# Altium schematic sheet TIDA-01576_ADS8686S_ISO_Interface_Pg3-PowerSupply.SchDoc
size 431 x 279 mm; Date: Not shown in title block; ApprovedBy: Not shown in title block; CheckedBy: Not shown in title block; Author: Not shown in title block; CompanyName: Not shown in title block; Engineer: Not shown in title block; Organization: Not shown in title block; Address1: Not shown in title block; Address2: Not shown in title block; Address3: Not shown in title block; Address4: Not shown in title block; DocumentNumber: 1; Revision: Use project parameter SCH_Rev; SheetNumber: 3; SheetTotal: 8; PageSetup: Record=PageOptions|CenterHorizontal=True|CenterVertical=True|PrintScale=1.00|XCorrection=1.00|YCorrection=1.00|PrintKind=0|BorderSize=5000000|LeftOffset=0|BottomOffset=0|Orientation=2|PaperLength=1000|PaperWidth=1000|Scale=100|PaperSource=15|PrintQuality=600|MediaType=1|DitherType=10|PaperKind=Letter|PrintScaleMode=1; CurrentTime: Not shown in title block; CurrentDate: Not shown in title block; Time: Not shown in title block; DocumentFullPathAndName: Not shown in title block; DocumentName: Not shown in title block; ModifiedDate: Not shown in title block; ImagePath: Not shown in title block
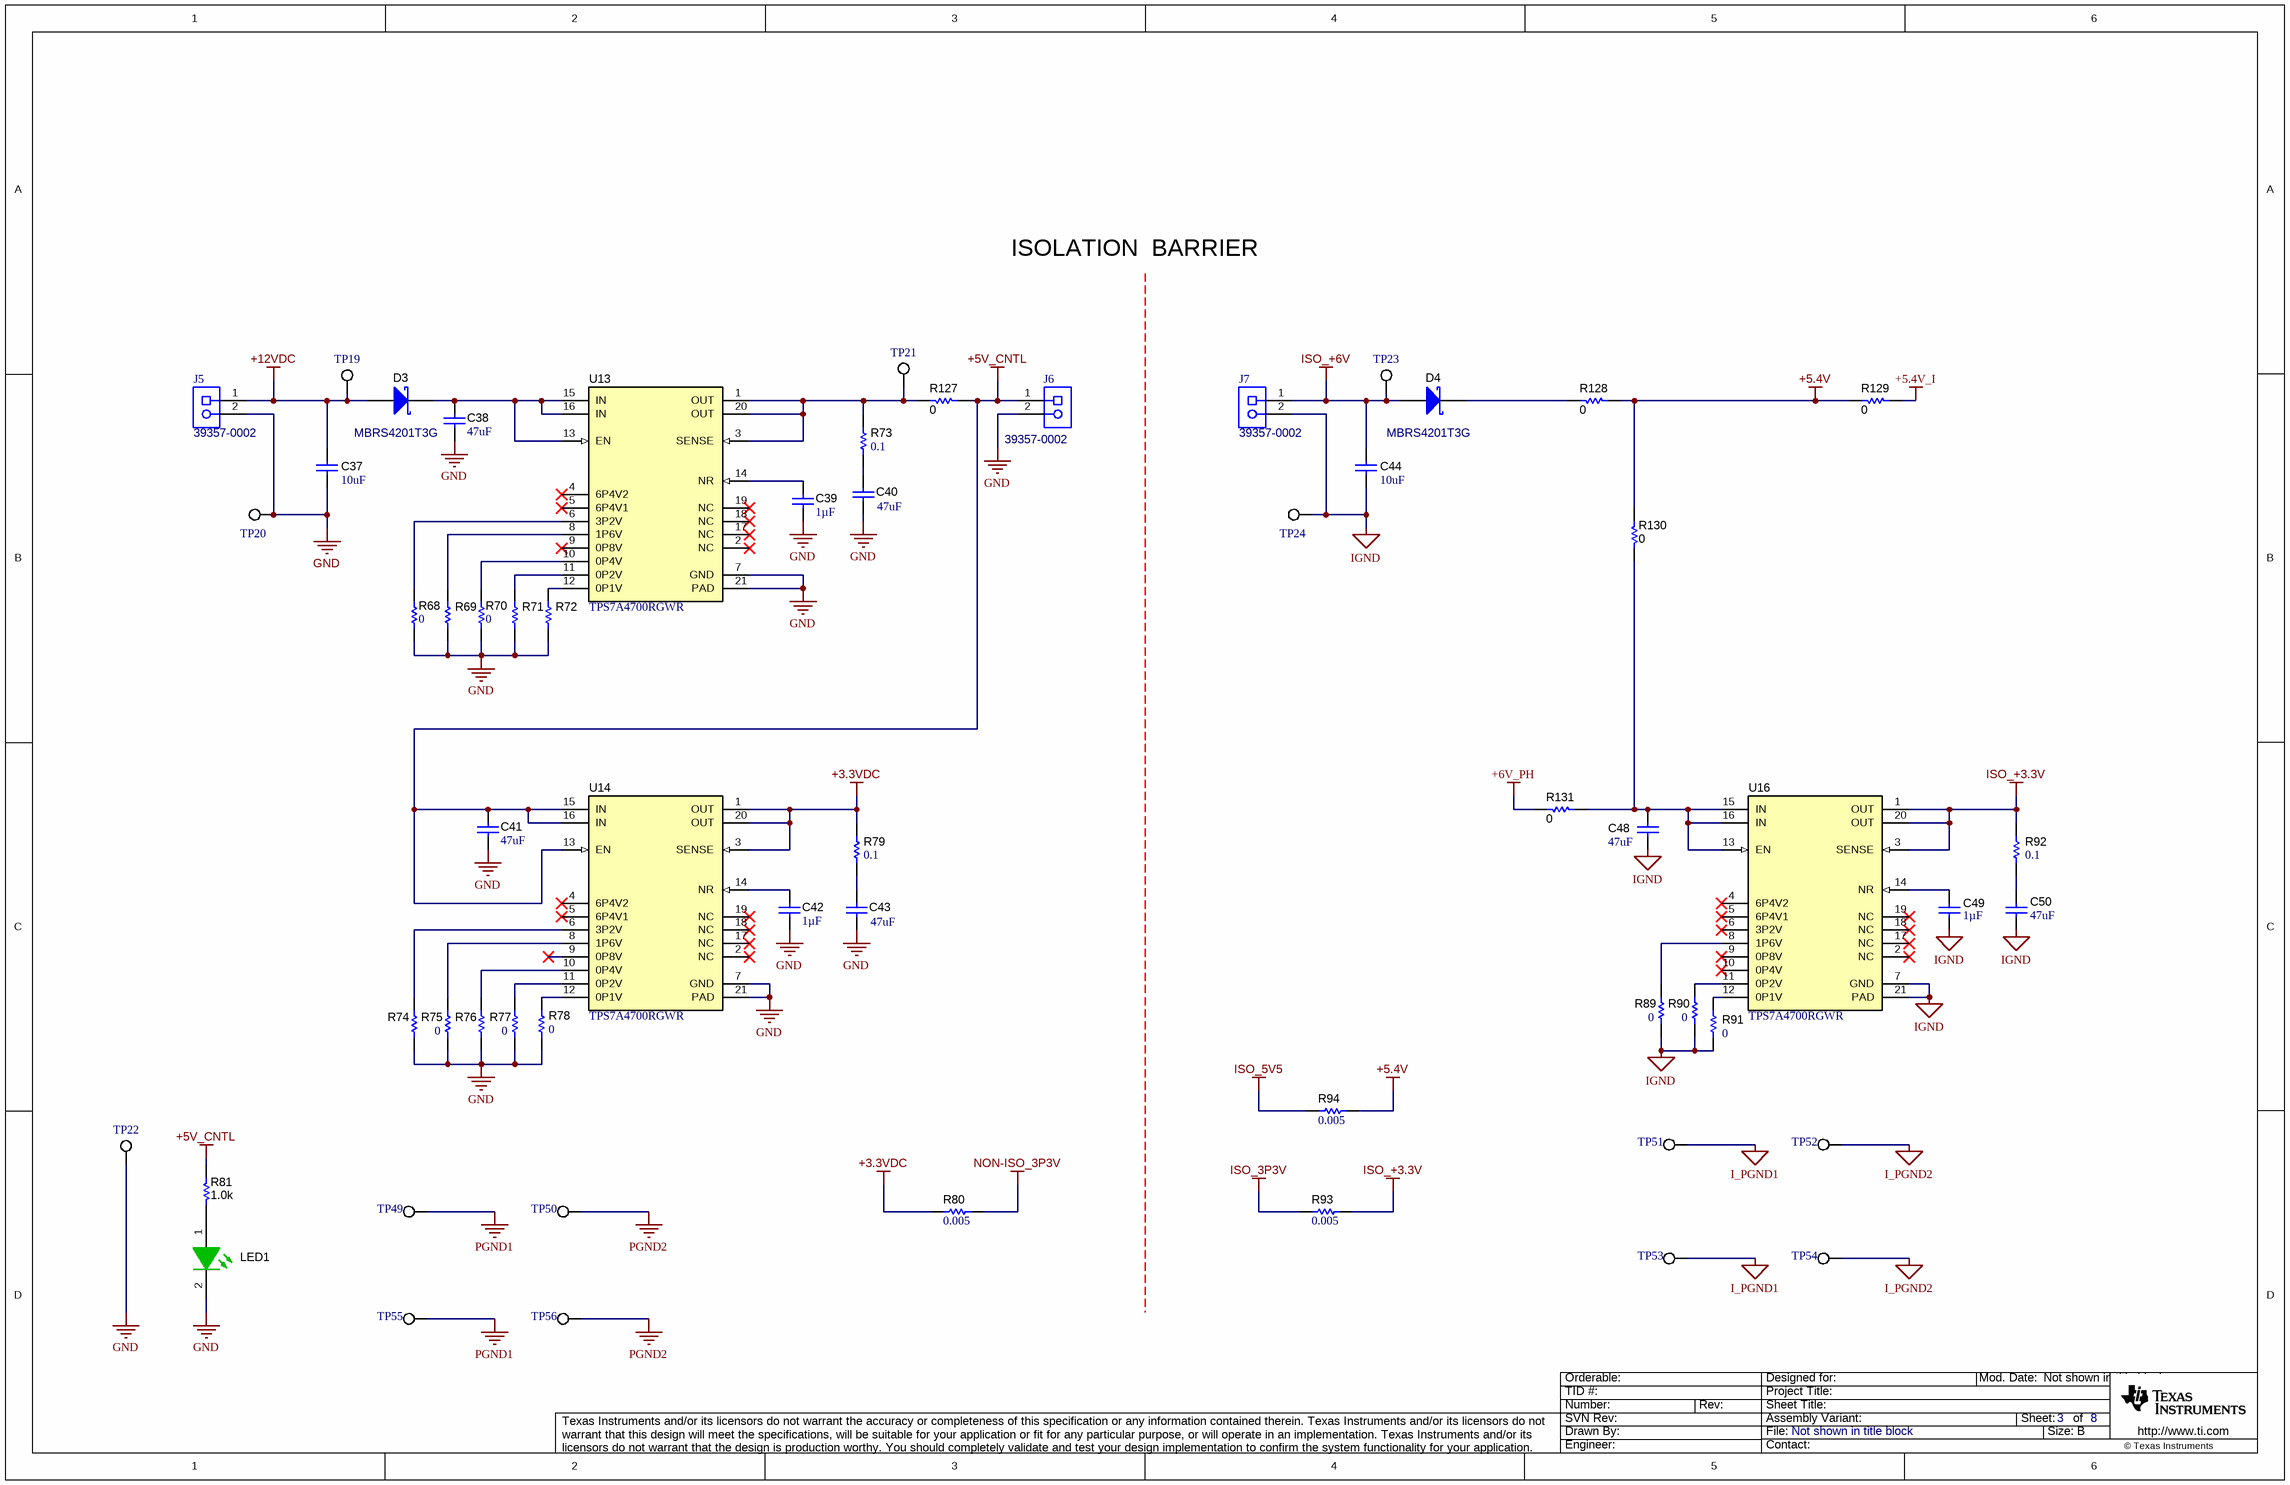
[diagram p0: TIDA-01576_ADS8686S_ISO_Interface_Pg3-PowerSupply.SchDoc]

## Parts
C37  ValueDisplayed: 10uF  [1210_270]  (hidden comment: GRM32ER71H106KA12L)
C38  ValueDisplayed: 47uF  [1206_190]  (hidden comment: C3216X5R1E476M160AC)
C39  Cap_F: 1µF  [0603]  (hidden comment: C1608X7R1C105K080AC)
C40  ValueDisplayed: 47uF  [0805_HV]  (hidden comment: C2012X5R1A476M125AC)
C41  ValueDisplayed: 47uF  [1206_190]  (hidden comment: C3216X5R1E476M160AC)
C42  Cap_F: 1µF  [0603]  (hidden comment: C1608X7R1C105K080AC)
C43  ValueDisplayed: 47uF  [0805_HV]  (hidden comment: C2012X5R1A476M125AC)
C44  ValueDisplayed: 10uF  [1210_270]  (hidden comment: GRM32ER71H106KA12L)
C48  ValueDisplayed: 47uF  [1206_190]  (hidden comment: C3216X5R1E476M160AC)
C49  Cap_F: 1µF  [0603]  (hidden comment: C1608X7R1C105K080AC)
C50  ValueDisplayed: 47uF  [0805_HV]  (hidden comment: C2012X5R1A476M125AC)
D3  MBRS4201T3G  [SMC]
D4  MBRS4201T3G  [SMC]
J5  39357-0002  [MOLEX_39357-0002]
J6  39357-0002  [MOLEX_39357-0002]
J7  39357-0002  [MOLEX_39357-0002]
LED1  LTST-C193TGKT-5A  [LTST-C193_Green_S]  (value not drawn)
R68  ValueDisplayed: 0  [0603]  (hidden comment: CRCW06030000Z0EA)
R69  CRCW06030000Z0EA  [0603]  (value not drawn)
R70  ValueDisplayed: 0  [0603]  (hidden comment: CRCW06030000Z0EA)
R71  CRCW06030000Z0EA  [0603]  (value not drawn)
R72  CRCW06030000Z0EA  [0603]  (value not drawn)
R73  ValueDisplayed: 0.1  [0603]  (hidden comment: ERJ-3RSFR10V)
R74  CRCW06030000Z0EA  [0603]  (value not drawn)
R75  ValueDisplayed: 0  [0603]  (hidden comment: CRCW06030000Z0EA)
R76  CRCW06030000Z0EA  [0603]  (value not drawn)
R77  ValueDisplayed: 0  [0603]  (hidden comment: CRCW06030000Z0EA)
R78  ValueDisplayed: 0  [0603]  (hidden comment: CRCW06030000Z0EA)
R79  ValueDisplayed: 0.1  [0603]  (hidden comment: ERJ-3RSFR10V)
R80  ValueDisplayed: 0.005  [0805_HV]  (hidden comment: ERJ6LWFR005V)
R81  ValueDisplayed: 1.0k  [0603]  (hidden comment: RC0603JR-071KL)
R89  ValueDisplayed: 0  [0603]  (hidden comment: CRCW06030000Z0EA)
R90  ValueDisplayed: 0  [0603]  (hidden comment: CRCW06030000Z0EA)
R91  ValueDisplayed: 0  [0603]  (hidden comment: CRCW06030000Z0EA)
R92  ValueDisplayed: 0.1  [0603]  (hidden comment: ERJ-3RSFR10V)
R93  ValueDisplayed: 0.005  [0805_HV]  (hidden comment: ERJ6LWFR005V)
R94  ValueDisplayed: 0.005  [0805_HV]  (hidden comment: ERJ6LWFR005V)
R127  ValueDisplayed: 0  [0603]  (hidden comment: CRCW06030000Z0EA)
R128  ValueDisplayed: 0  [0603]  (hidden comment: CRCW06030000Z0EA)
R129  ValueDisplayed: 0  [0603]  (hidden comment: CRCW06030000Z0EA)
R130  ValueDisplayed: 0  [0603]  (hidden comment: CRCW06030000Z0EA)
R131  ValueDisplayed: 0  [0603]  (hidden comment: CRCW06030000Z0EA)
TP19  5015  [Testpoint_Keystone_Miniature]  (value not drawn)
TP20  5015  [Testpoint_Keystone_Miniature]  (value not drawn)
TP21  5015  [Testpoint_Keystone_Miniature]  (value not drawn)
TP22  5015  [Testpoint_Keystone_Miniature]  (value not drawn)
TP23  5015  [Testpoint_Keystone_Miniature]  (value not drawn)
TP24  5015  [Testpoint_Keystone_Miniature]  (value not drawn)
TP49  5015  [Testpoint_Keystone_Miniature]  (value not drawn)
TP50  5015  [Testpoint_Keystone_Miniature]  (value not drawn)
TP51  5015  [Testpoint_Keystone_Miniature]  (value not drawn)
TP52  5015  [Testpoint_Keystone_Miniature]  (value not drawn)
TP53  5015  [Testpoint_Keystone_Miniature]  (value not drawn)
TP54  5015  [Testpoint_Keystone_Miniature]  (value not drawn)
TP55  5015  [Testpoint_Keystone_Miniature]  (value not drawn)
TP56  5015  [Testpoint_Keystone_Miniature]  (value not drawn)
U13  TPS7A4700RGWR  [RGW0020A]
U14  TPS7A4700RGWR  [RGW0020A]
U16  TPS7A4700RGWR  [RGW0020A]

## Nets
+3.3VDC: R79.2 R80.2 U14.1(OUT) U14.3(SENSE) U14.20(OUT)
+5.4V: R94.2 R128.1 R129.2 R130.1
+5.4V_I: R129.1
+5V_CNTL: C41.1 J6.1 R81.2 R127.1 U14.13(EN) U14.15(IN) U14.16(IN)
+6V_PH: R131.1
+12VDC: C37.1 D3.2(A) J5.1 TP19.1
GND: C37.2 C38.2 C39.2 C40.2 C41.2 C42.2 C43.2 J5.2 J6.2 LED1.2(K) R68.1 R69.1 R70.1 R71.1 R72.1 R74.1 R75.1 R76.1 R77.1 R78.1 TP20.1 TP22.1 U13.7(GND) U13.21(PAD) U14.7(GND) U14.21(PAD)
I_PGND1: TP51.1 TP53.1
I_PGND2: TP52.1 TP54.1
IGND: C44.2 C48.2 C49.2 C50.2 J7.2 R89.1 R90.1 R91.1 TP24.1 U16.7(GND) U16.21(PAD)
ISO_3P3V: R93.1
ISO_5V5: R94.1
ISO_+3.3V: R92.2 R93.2 U16.1(OUT) U16.3(SENSE) U16.20(OUT)
ISO_+6V: C44.1 D4.2(A) J7.1 TP23.1
NON-ISO_3P3V: R80.1
PGND1: TP49.1 TP55.1
PGND2: TP50.1 TP56.1
NetC38_1: C38.1 D3.1(K) U13.13(EN) U13.15(IN) U13.16(IN)
NetC39_1: C39.1 U13.14(NR)
NetC40_1: C40.1 R73.1
NetC42_1: C42.1 U14.14(NR)
NetC43_1: C43.1 R79.1
NetC48_1: C48.1 R130.2 R131.2 U16.13(EN) U16.15(IN) U16.16(IN)
NetC49_1: C49.1 U16.14(NR)
NetC50_1: C50.1 R92.1
NetD4_1: D4.1(K) R128.2
NetLED1_1: LED1.1(A) R81.1
NetR68_2: R68.2 U13.6(3P2V)
NetR69_2: R69.2 U13.8(1P6V)
NetR70_2: R70.2 U13.10(0P4V)
NetR71_2: R71.2 U13.11(0P2V)
NetR72_2: R72.2 U13.12(0P1V)
NetR73_2: R73.2 R127.2 TP21.1 U13.1(OUT) U13.3(SENSE) U13.20(OUT)
NetR74_2: R74.2 U14.6(3P2V)
NetR75_2: R75.2 U14.8(1P6V)
NetR76_2: R76.2 U14.10(0P4V)
NetR77_2: R77.2 U14.11(0P2V)
NetR78_2: R78.2 U14.12(0P1V)
NetR89_2: R89.2 U16.8(1P6V)
NetR90_2: R90.2 U16.11(0P2V)
NetR91_2: R91.2 U16.12(0P1V)

Not connected (* = marked no-connect by the designer): U13 2(NC)* 4(6P4V2)* 5(6P4V1)* 9(0P8V)* 17(NC)* 18(NC)* 19(NC)*; U14 2(NC)* 4(6P4V2)* 5(6P4V1)* 9(0P8V)* 17(NC)* 18(NC)* 19(NC)*; U16 2(NC)* 4(6P4V2)* 5(6P4V1)* 6(3P2V)* 9(0P8V)* 10(0P4V)* 17(NC)* 18(NC)* 19(NC)*

## Notes on the sheet
- ISOLATION  BARRIER
- Drawn By:
- SVN Rev:
- Number:
- TID #:
- Orderable:
- Rev:
- Sheet Title:
- File:
- Project Title:
- Designed for:
- Assembly Variant:
- Mod. Date:
- Sheet:
- Size:
- of
- B
- http://www.ti.com
- Texas Instruments and/or its licensors do not warrant the accuracy or completeness of this specification or any information contained therein. Texas Instruments and/or its licensors do not warrant that this design will meet the specifications, will be suitable for your application or fit for any particular purpose, or will operate in an implementation. Texas Instruments and/or its licensors do not warrant that the design is production worthy. You should completely validate and test your design implementation to confirm the system functionality for your application.
- Engineer:
- Contact:
- © Texas Instruments

## Library data of the parts
C37 C44 = CMP-0009226-3: CAP, CERM, 10 uF, 50 V, +/- 10%, X7R, 1210; Manufacturer: MuRata; TaMin_C: -55°C; Polarized: N; SizeAreaWB_mm2: 14.7; Value1: Unknown; U/M: EA; Value: 10uF; TaMax_C: 125°C; SizeZ_mm: 2.7; SizeX_mm: 3.2; SizeY_mm: 2.5; Cap_Case: 1210; Value2: 50V; SizeArea_mm2: 8; Cap_F: 10µF; AEC Category: Q200; Supplier Part Number 2: 40X5911; Supplier 2: Newark; TempCo: X7R; RoHS: Y; MountType: SMT; Supplier 1: Digi-Key; PackageReference: 1210; Tolerance_%: 10%; CompType: Capacitor; PartNumber: GRM32ER71H106KA12L; AEC Qualified: N; VDC_V: 50V; ComponentLink1Description: Datasheet link; Supplier Part Number 1: 490-6544-1-ND; Technology: Ceramic; ComponentLink1URL: http://search.murata.co.jp/Ceramy/image/img/A01X/G101/ENG/GRM32ER71H106KA12-04A.pdf; AEC Grade: N/A; Supplier 3: Mouser; Supplier Part Number 3: 81-GRM32ER71H106KA2L
C38 C41 = CMP-0008656-1: CAP, CERM, 47 uF, 25 V, +/- 20%, X5R, 1206_190; Manufacturer: TDK; TaMin_C: -55°C; Polarized: N; SizeAreaWB_mm2: 10.92; Value1: Unknown; U/M: EA; Value: 47uF; TaMax_C: 85°C; SizeZ_mm: 1.9; SizeX_mm: 3.2; SizeY_mm: 1.6; Cap_Case: 1206; Value2: 25V; SizeArea_mm2: 5.12; Cap_F: 47µF; AEC Category: Q200; ComponentLink1URL: https://product.tdk.com/info/en/catalog/datasheets/mlcc_commercial_general_en.pdf; Publisher: Texas Instruments; TempCo: X5R; Published: 2008-06-19; RoHS: Y; MountType: SMT; Supplier 1: Digi-Key; PackageReference: 1206_190; Tolerance_%: 20%; CompType: Capacitor; LatestRevisionDate: 2017-03-09; PartNumber: C3216X5R1E476M160AC; AEC Qualified: N; VDC_V: 25V; ComponentLink1Description: Datasheet link; AEC Grade: N/A; Supplier Part Number 1: 445-8047-1-ND; Technology: Ceramic
C39 C42 C49 = CMP-0007037-1: CAP, CERM, 1 uF, 16 V, +/- 10%, X7R, 0603; Manufacturer: TDK; TaMin_C: -55°C; ESR_ohm: 5.7m; Polarized: N; SizeAreaWB_mm2: 4.68; Value1: 0.0057 ohm; U/M: EA; Value: 1uF; TaMax_C: 125°C; SizeZ_mm: 1; SizeX_mm: 1.6; SizeY_mm: 0.8; Value2: 16V; SizeArea_mm2: 1.28; AEC Category: Q200; ComponentLink1URL: http://www.tdk.co.jp/tefe02/e412_c.pdf; Supplier Part Number 2: 90R7686; Publisher: Texas Instruments; Supplier 2: Newark; Supplier Part Number 3: 810-C1608X7R1C105K; TempCo: X7R; Supplier 3: Mouser; Published: 2008-06-19; RoHS: Y; MountType: SMT; Supplier 1: Digi-Key; PackageReference: 0603; Tolerance_%: 10%; Cap_Case: 0603; CompType: Capacitor; LatestRevisionDate: 2017-03-09; PartNumber: C1608X7R1C105K080AC; AEC Qualified: ?; VDC_V: 16V; ComponentLink1Description: Datasheet link; Supplier Part Number 1: 445-1604-1-ND; Technology: Ceramic; ValueDisplayed: 1uF
C40 C43 C50 = CMP-0007825-1: CAP, CERM, 47 uF, 10 V, +/- 20%, X5R, 0805; Manufacturer: TDK; TaMin_C: -55°C; ESR_ohm: 2.94m; Polarized: N; SizeAreaWB_mm2: 6.75; Value1: 0.00294 ohm; U/M: EA; Value: 47uF; TaMax_C: 85°C; SizeZ_mm: 1.45; SizeX_mm: 2; SizeY_mm: 1.25; Cap_Case: 0805; Value2: 10V; SizeArea_mm2: 2.5; Cap_F: 47µF; IRMS_A: 3.80451A; AEC Category: Q200; ComponentLink1URL: https://product.tdk.com/en/search/capacitor/ceramic/mlcc/info?part_no=C2012X5R1A476M125AC; Supplier Part Number 2: 810-C2012X5R1A476M125AC; Publisher: Texas Instruments; Supplier 2: Mouser; TempCo: X5R; Published: 2008-06-19; RoHS: Y; MountType: SMT; Supplier 1: Digi-Key; PackageReference: 0805; Tolerance_%: 20%; CompType: Capacitor; LatestRevisionDate: 2017-03-09; PartNumber: C2012X5R1A476M125AC; AEC Qualified: N; VDC_V: 10V; ComponentLink1Description: Datasheet link; AEC Grade: N/A; Supplier Part Number 1: 445-8239-1-ND; Technology: Ceramic
C48 = CMP-0008656-2: CAP, CERM, 47 uF, 25 V, +/- 20%, X5R, 1206_190; Manufacturer: TDK; TaMin_C: -55°C; Polarized: N; SizeAreaWB_mm2: 10.92; Value1: Unknown; U/M: EA; Value: 47uF; TaMax_C: 85°C; SizeZ_mm: 1.9; SizeX_mm: 3.2; SizeY_mm: 1.6; Cap_Case: 1206; Value2: 25V; SizeArea_mm2: 5.12; Cap_F: 47µF; AEC Category: Q200; Publisher: Texas Instruments; TempCo: X5R; Published: 2008-06-19; RoHS: Y; MountType: SMT; Supplier 1: Digi-Key; PackageReference: 1206_190; Tolerance_%: 20%; CompType: Capacitor; LatestRevisionDate: 2017-03-09; PartNumber: C3216X5R1E476M160AC; AEC Qualified: N; VDC_V: 25V; ComponentLink1Description: Datasheet link; AEC Grade: N/A; Supplier Part Number 1: 445-8047-1-ND; Technology: Ceramic; ComponentLink1URL: https://product.tdk.com/info/en/catalog/datasheets/mlcc_commercial_general_en.pdf
D3 D4 = CMP-0076995-1: Diode, Schottky, 200 V, 4 A, SMC; Manufacturer: ON Semiconductor; SizeAreaWB_mm2: 83.2686; Vr_V: 200V; SizeArea_mm2: 50.5686; TJmax_C: 150°C; AEC Category: Q101; Value: 200V; SizeZ_mm: 2.6; Green_REACh: Incomplete; Io_A: 4A; Vf_V: 860mV; SizeY_mm: 6.22; Value2: 0.86V; Green_Lifecycle: Not Set; U/M: EA; SizeX_mm: 8.13; ComponentLink1Description: Datasheet link; RoHS: Y; Supplier Part Number 3: 863-MBRS4201T3G; Supplier 1: Digi-Key; AEC Qualified: ?; Green_EU RoHS: Incomplete; PackageReference: SMC; PartNumber: MBRS4201T3G; Publisher: Texas Instruments; Supplier Part Number 2: 29X6031; Supplier 2: Newark; Published: 2008-06-26; LatestRevisionDate: 2017-07-25; ComponentLink1URL: http://www.onsemi.com/pub_link/Collateral/MBRS4201T3-D.PDF; Value1: 4A; CompType: Diode; MountType: SMT; Supplier Part Number 1: MBRS4201T3GOSCT-ND; Supplier 3: Mouser; Type: Schottky; Green_EU RoHS-2: Incomplete
J5-J7 = CMP-0055341-1: Terminal Block, 3.5 mm, 2x1, Tin, TH; Manufacturer: Molex; CNHeader: FALSE; Green_Lifecycle: Not Set; Green_REACh: Incomplete; CT: TRUE; ComponentLink1URL: http://www.molex.com/pdm_docs/sd/393570002_sd.pdf; Supplier Part Number 2: 72K2104; Publisher: Texas Instruments; Supplier 2: Newark; Supplier Part Number 3: 538-39357-0002; Supplier 3: Mouser; RoHS: Y; MountType: TH; Green_EU RoHS-2: Incomplete; Supplier 1: Digi-Key; Green_EU RoHS: Incomplete; PackageReference: Terminal Block, 3.5 mm, 2x1, TH; CompType: Terminal Block; LatestRevisionDate: 26/05/2017; PartNumber: 39357-0002; ComponentLink1Description: Datasheet URL; Supplier Part Number 1: WM7877-ND
LED1 = CMP-0080580-2: LED, Green, SMD; Manufacturer: Lite-On; SizeZ_mm: 0.45; SizeX_mm: 1.6; Angle: 130; SizeArea_mm2: 1.28; Power_TotalModule: 76mW; Vf_V: 2.8V; Io_A: 5mA; SizeAreaWB_mm2: 4.68; Type: InGaN; Ir_A: 10µA; Value1: 0.076W; Tjmax_C: 80°C; SizeY_mm: 0.8; Vr_V: 5V; PackageReference: Body1.6x0.8mm; Color: Green; RoHS: Y; CompType: LED; PartNumber: LTST-C193TGKT-5A; ComponentLink1URL: https://sps16.itg.ti.com/sites/KMS/crossdivteams/altium/docs/ComponentDatasheets/LTST-C193TGKT-5A.pdf; MountType: SMT; Value: Green; Value2: 2.8V; ComponentLink1Description: Datasheet link
R68-R72 R74-R78 R89-R91 = CMP-0025697-1: RES, 0, 5%, 0.1 W, 0603; Manufacturer: Vishay-Dale; Power_W: 100mW; TempCo: 200 ppm/C; Value_Code: 0000; U/M: EA; Value: 0; EIA_Code: E24; SizeX_mm: 1.6; SizeY_mm: 0.8; SizeZ_mm: 1; Value2: 0.1W; SizeArea_mm2: 1.28; VDC_V: 75V; AEC Category: Q200; ComponentLink1URL: http://www.vishay.com/docs/20035/dcrcwe3.pdf; Supplier Part Number 2: 52K8014; Publisher: Texas Instruments; Supplier 2: Newark; Supplier Part Number 3: 71-CRCW0603-0-E3; Supplier 3: Mouser; Published: 2008-06-26; RoHS: Y; Value1: 5%; MountType: SMT; Supplier 1: Digi-Key; PackageReference: 0603; Tolerance_%: 5%; Res_ohm: 0; CompType: Resistor; LatestRevisionDate: 2017-03-09; PartNumber: CRCW06030000Z0EA; AEC Qualified: ?; ComponentLink1Description: Datasheet link; Supplier Part Number 1: 541-0.0GCT-ND; Technology: Thick Film
  R69 R71 R72 R74 R76: ValueDisplayed: 0
R73 R79 R92 = CMP-0022721-1: RES, 0.1, 1%, 0.1 W, 0603; Manufacturer: Panasonic; Power_W: 100mW; TempCo: 300 ppm/C; Value_Code: R100; U/M: EA; Value: 0.1; EIA_Code: E96; SizeX_mm: 1.6; SizeY_mm: 0.8; SizeZ_mm: 1; Value2: 0.1W; SizeArea_mm2: 1.28; AEC Category: Q200; ComponentLink1URL: http://www.panasonic.com/industrial/components/pdf/AOA0000CE3.pdf; Supplier Part Number 2: 667-ERJ-3RSFR10V; Publisher: Texas Instruments; Supplier 2: Mouser; Supplier Part Number 3: 1717759; Supplier 3: Farnell; Published: 2008-06-26; RoHS: Y; Value1: 1%; MountType: SMT; Supplier 1: Digi-Key; PackageReference: 0603; Tolerance_%: 1%; Res_ohm: 0.1; CompType: Resistor; LatestRevisionDate: 2017-03-09; PartNumber: ERJ-3RSFR10V; AEC Qualified: ?; ComponentLink1Description: Datasheet link; Supplier Part Number 1: P.10AJCT-ND; Technology: Thick Film
R80 R93 R94 = CMP-0079631-1: RES, 0.005, 1%, 0.5 W, AEC-Q200 Grade 1, 0805; Manufacturer: Panasonic; Power_W: 500mW; TempCo: 300 ppm/C; SizeAreaWB_mm2: 6.75; Value_Code: 5L000; Value: 0.005; EIA_Code: E96; Res_ohm: 5m; SizeX_mm: 2; SizeY_mm: 1.25; SizeZ_mm: 1.45; Value2: 0.5W; SizeArea_mm2: 2.5; AEC Qualified: Y; AEC Grade: 1; AEC Category: Q200; ComponentLink1URL: https://industrial.panasonic.com/cdbs/www-data/pdf/RDN0000/AOA0000C313.pdf; Supplier Part Number 2: 667-ERJ-6LWFR005V; Supplier 2: Mouser; RoHS: Y; Value1: 1%; MountType: SMT; Supplier 1: Digi-Key; PackageReference: 0805; Tolerance_%: 1%; CompType: Resistor; PartNumber: ERJ6LWFR005V; ComponentLink1Description: Datasheet link; Supplier Part Number 1: P19183CT-ND; Technology: Thick Film
R81 = RC0603JR-071KL: RES, 1.0 k, 5%, 0.1 W, 0603; Manufacturer: Yageo America; CompType: Resistor; Value: 1.0k; Res_ohm: 1000; Value_Code: 1k00; Tolerance_%: 5; Power_W: 0.1; Value2: 0.1W; VDC_V: 50; TempCo: 100 ppm/C; SizeArea_mm2: 1.28; SizeX_mm: 1.6; SizeY_mm: 0.8; SizeZ_mm: 1; EIA_Code: E24; U/M: EA; AEC Category: Q200; Green_Lifecycle: Active; Green_REACh: Passed; SymbolVersion: 2009-05-29; PartNumber: RC0603JR-071KL; PackageReference: 0603; RoHS: Y; Value1: 5%; MountType: SMT; Technology: Thick Film; Published: 2008-06-26; Publisher: Texas Instruments; LatestRevisionDate: 2017-06-13; ComponentLink1Description: Datasheet link; ComponentLink1URL: http://www.yageo.com/pdf/Pu-RC0603_51_PbFree_L_2.pdf; Supplier 1: Digi-Key; Supplier Part Number 1: 311-1.0KGRCT-ND; Supplier 2: Mouser; Supplier Part Number 2: 603-RC0603JR-071KL; Supplier 3: Farnell; Supplier Part Number 3: 9233385; AEC Qualified: ?; Green_EU RoHS: Passed with Exemption; Green_EU RoHS-2: Passed
R127-R131 = CRCW06030000Z0EA: RES, 0, 5%, 0.1 W, 0603; Manufacturer: Vishay-Dale; CompType: Resistor; Value: 0; Value_Code: 0000; Tolerance_%: 5; Power_W: 0.1; Value2: 0.1W; VDC_V: 75; TempCo: 200 ppm/C; EIA_Code: E24; U/M: EA; SymbolVersion: 2009-05-29; PartNumber: CRCW06030000Z0EA; PackageReference: 0603; RoHS: Y; Res_ohm: 0; Value1: 5%; MountType: SMT; Technology: Thick Film; Published: 2008-06-26; Publisher: Texas Instruments; LatestRevisionDate: 2014-10-21; ComponentLink1Description: Datasheet link; ComponentLink1URL: http://www.vishay.com/docs/20035/dcrcwe3.pdf; Supplier 1: Digi-Key; Supplier Part Number 1: 541-0.0GCT-ND; Supplier 2: Mouser; Supplier Part Number 2: 71-CRCW0603-0-E3; Supplier 3: Farnell; Supplier Part Number 3: 1469739
TP19-TP24 TP49-TP56 = CMP-0055152-1: Test Point, Miniature, SMT; Manufacturer: Keystone; CNHeader: FALSE; Green_Lifecycle: Active; Green_REACh: Passed; CT: TRUE; ComponentLink1URL: http://www.keyelco.com/userAssets/store/files/5015.PDF; Supplier Part Number 2: 534-5015; Publisher: Texas Instruments; Supplier 2: Mouser; RoHS: Y; MountType: SMT; Green_EU RoHS-2: Incomplete; Supplier 1: Digi-Key; Green_EU RoHS: Passed; PackageReference: Testpoint_Keystone_Miniature; CompType: Test Point; LatestRevisionDate: 26/05/2017; PartNumber: 5015; ComponentLink1Description: Datasheet URL; Supplier Part Number 1: 36-5015TR-ND
U13 U14 U16 = CMP-0066918-1: 36-V, 1-A, 4.17-uVRMS, RF LDO Voltage Regulator, RGW0020A (VQFN-20); Alternate PartNumber: TPS7A4700RGWT; Alternate Manufacturer: Texas Instruments; Green_Lifecycle: Active; SizeAreaWB_mm2: 49.0; Green_REACh: Passed; U/M: EA; SizeZ_mm: 1.0; SizeX_mm: 5.0; SizeArea_mm2: 25.0; CompType: IC; ComponentLink1URL: http://www.ti.com/lit/ds/symlink/tps7a47.pdf; Publisher: Texas Instruments; PackageDescription: VQFN-20; RoHS: Y; Footprint Path 6: C:\AltiumLibraries\Footprints\TI\.PcbLib; MountType: SMT; Green_EU RoHS-2: Passed; Manufacturer: Texas Instruments; Green_EU RoHS: Passed; PackageReference: RGW0020A; SizeY_mm: 5.0; LatestRevisionDate: 2017-06-09; PartNumber: TPS7A4700RGWR; ComponentLink1Description: Datasheet Link